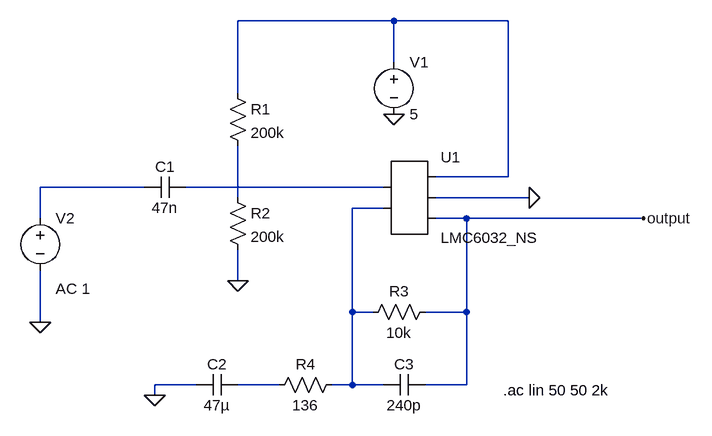
[diagram p0: schematic amp_filter.asc]
amp_filter.asc, the LTspice schematic file:
Version 4
SHEET 1 880 680
WIRE 144 -112 -96 -112
WIRE 320 -112 144 -112
WIRE 144 -48 144 -112
WIRE -96 0 -96 -112
WIRE 320 128 320 -112
WIRE 320 128 208 128
WIRE -240 144 -400 144
WIRE 128 144 -176 144
WIRE -96 160 -96 80
WIRE 352 160 208 160
WIRE 128 176 80 176
WIRE -400 192 -400 144
WIRE 256 192 208 192
WIRE 528 192 256 192
WIRE -96 288 -96 240
WIRE 80 336 80 176
WIRE 112 336 80 336
WIRE 256 336 256 192
WIRE 256 336 192 336
WIRE -400 352 -400 272
WIRE -160 448 -224 448
WIRE -32 448 -96 448
WIRE 80 448 80 336
WIRE 80 448 48 448
WIRE 128 448 80 448
WIRE 256 448 256 336
WIRE 256 448 192 448
WIRE -224 464 -224 448
FLAG -224 464 0
FLAG -96 288 0
FLAG 352 160 0
FLAG 144 32 0
FLAG 528 192 output
FLAG -400 352 0
SYMBOL AutoGenerated\\LMC6032_NS 160 160 R0
SYMATTR InstName U1
SYMBOL res -112 -16 R0
SYMATTR InstName R1
SYMATTR Value 200k
SYMBOL res -112 144 R0
SYMATTR InstName R2
SYMATTR Value 200k
SYMBOL cap -176 128 R90
WINDOW 0 0 32 VBottom 2
WINDOW 3 32 32 VTop 2
SYMATTR InstName C1
SYMATTR Value 47n
SYMBOL cap -96 432 R90
WINDOW 0 0 32 VBottom 2
WINDOW 3 32 32 VTop 2
SYMATTR InstName C2
SYMATTR Value 47µ
SYMBOL cap 192 432 R90
WINDOW 0 0 32 VBottom 2
WINDOW 3 32 32 VTop 2
SYMATTR InstName C3
SYMATTR Value 240p
SYMBOL res 208 320 R90
WINDOW 0 0 56 VBottom 2
WINDOW 3 32 56 VTop 2
SYMATTR InstName R3
SYMATTR Value 10k
SYMBOL res 64 432 R90
WINDOW 0 0 56 VBottom 2
WINDOW 3 32 56 VTop 2
SYMATTR InstName R4
SYMATTR Value 136
SYMBOL voltage 144 -64 R0
WINDOW 123 0 0 Left 0
WINDOW 39 0 0 Left 0
SYMATTR InstName V1
SYMATTR Value 5
SYMBOL voltage -400 176 R0
WINDOW 123 24 124 Left 2
WINDOW 39 0 0 Left 0
SYMATTR InstName V2
SYMATTR Value ""
SYMATTR Value2 AC 1
TEXT 312 456 Left 2 !.ac lin 50 50 2k

The netlist it stands for:
* amp_filter.asc
* U1: LMC6032_NS (symbol AutoGenerated\LMC6032_NS not available, pins judged from their places): pin1=N003 pin2=N005 pin3=N001 pin4=0 pin5=output
R1 N001 N004 200k
R2 N004 0 200k
C1 N003 N002 47n
C2 N006 0 47µ
C3 output N005 240p
R3 output N005 10k
R4 N005 N006 136
V1 N001 0 5
V2 N002 0 AC 1
.ac lin 50 50 2k
.backanno
.end